# Altium schematic sheet motordriver-v3.1_config_IO.SchDoc
size A
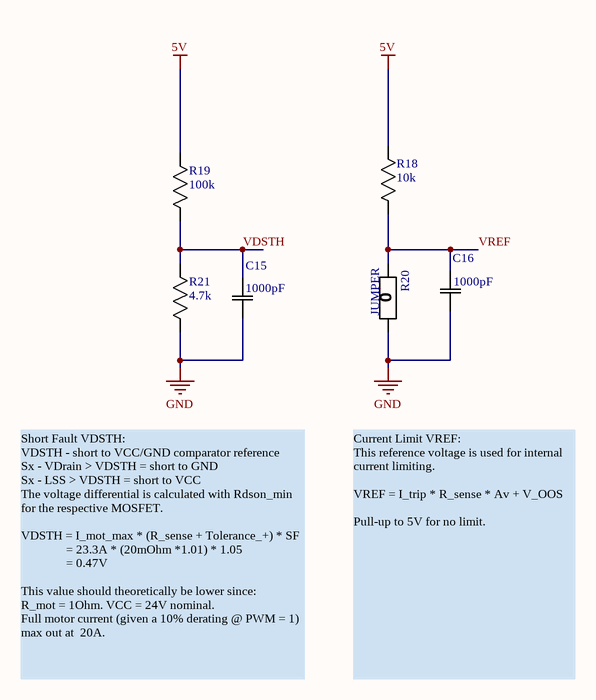
[diagram p0: motordriver-v3.1_config_IO.SchDoc]

## Parts
C15  1000pF  [0805]
C16  1000pF  [0805]
R18  10k  [0805]
R19  100k  [0805]
R20  JUMPER  [0805]
R21  4.7k  [0805]

## Nets
5V: R18.1(R1) R19.1(R1)
GND: C15.1(C1) C16.1(C1) R20.1(R1) R21.2(R2)
VDSTH: C15.2(C2) R19.2(R2) R21.1(R1)
VREF: C16.2(C2) R18.2(R2) R20.2(R2)

## Notes on the sheet
- Short Fault VDSTH:
  VDSTH - short to VCC/GND comparator reference
  Sx - VDrain > VDSTH = short to GND
  Sx - LSS > VDSTH = short to VCC
  The voltage differential is calculated with Rdson_min for the respective MOSFET.
  VDSTH = I_mot_max * (R_sense + Tolerance_+) * SF
  = 23.3A * (20mOhm *1.01) * 1.05
  = 0.47V
  This value should theoretically be lower since:
  R_mot = 1Ohm. VCC = 24V nominal.
  Full motor current (given a 10% derating @ PWM = 1) max out at  20A.
- Current Limit VREF:
  This reference voltage is used for internal current limiting.
  VREF = I_trip * R_sense * Av + V_OOS
  Pull-up to 5V for no limit.

## Library data of the parts
C15 C16 = CAP 1000pF 50V: CAP CER 1000PF 50V X7R 0603/0805; Tolerance: 10%; Package: 0603/0805; Value: 1000pF; Rating: 50V; Temperature Coefficient: X7R; Operating Temperature: -55°C ~ 125°C
R18 = RES 10k 1/8W - 1%: RES SMD 10K OHM 1% 1/8W 0805; Power (Watts): 0.125W; Package: 0805; Value: 10k; Tolerance: 1%
R19 = RES 100k 1/8W - 1%: RES SMD 100K OHM 1% 1/8W 0805; Power (Watts): 0.125W; Package: 0805; Value: 100k; Tolerance: 1%
R20 = RES 0 JUMPER: RES SMD 0 OHM JUMPER GENERIC 0805; Value: 0; Package: 0805
R21 = RES 4.7k 1/8W - 1%: RES SMD 4.7k OHM 1% 1/8W 0805; Power (Watts): 0.125W; Package: 0805; Value: 4.7k; Tolerance: 1%